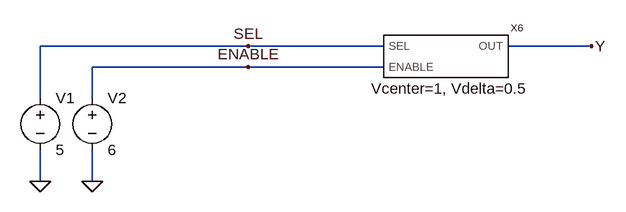
[diagram p0: schematic selectors.asc]
selectors.asc, the LTspice schematic file:
Version 4
SHEET 1 880 680
WIRE 192 176 -128 176
WIRE 400 176 192 176
WIRE 720 176 592 176
WIRE 192 208 -48 208
WIRE 400 208 192 208
WIRE -128 256 -128 176
WIRE -48 256 -48 208
WIRE -128 384 -128 336
WIRE -48 384 -48 336
FLAG 720 176 Y
FLAG 192 208 ENABLE
FLAG 192 176 SEL
FLAG -128 384 0
FLAG -48 384 0
SYMBOL selector-element 496 192 R0
WINDOW 39 -115 49 Left 2
SYMATTR SpiceLine Vcenter=1, Vdelta=0.5
SYMATTR InstName X6
SYMBOL voltage -128 240 R0
WINDOW 123 0 0 Left 2
WINDOW 39 0 0 Left 2
SYMATTR InstName V1
SYMATTR Value 5
SYMBOL voltage -48 240 R0
WINDOW 123 0 0 Left 2
WINDOW 39 0 0 Left 2
SYMATTR InstName V2
SYMATTR Value 6

The netlist it stands for:
* selectors.asc
XX6 SEL ENABLE Y selector-element Vcenter=1, Vdelta=0.5  ; pins SEL ENABLE OUT
V1 SEL 0 5
V2 ENABLE 0 6
.backanno
.end